# EAGLE design Tecla Shield Through Hole V1 (EAGLE 5.07)
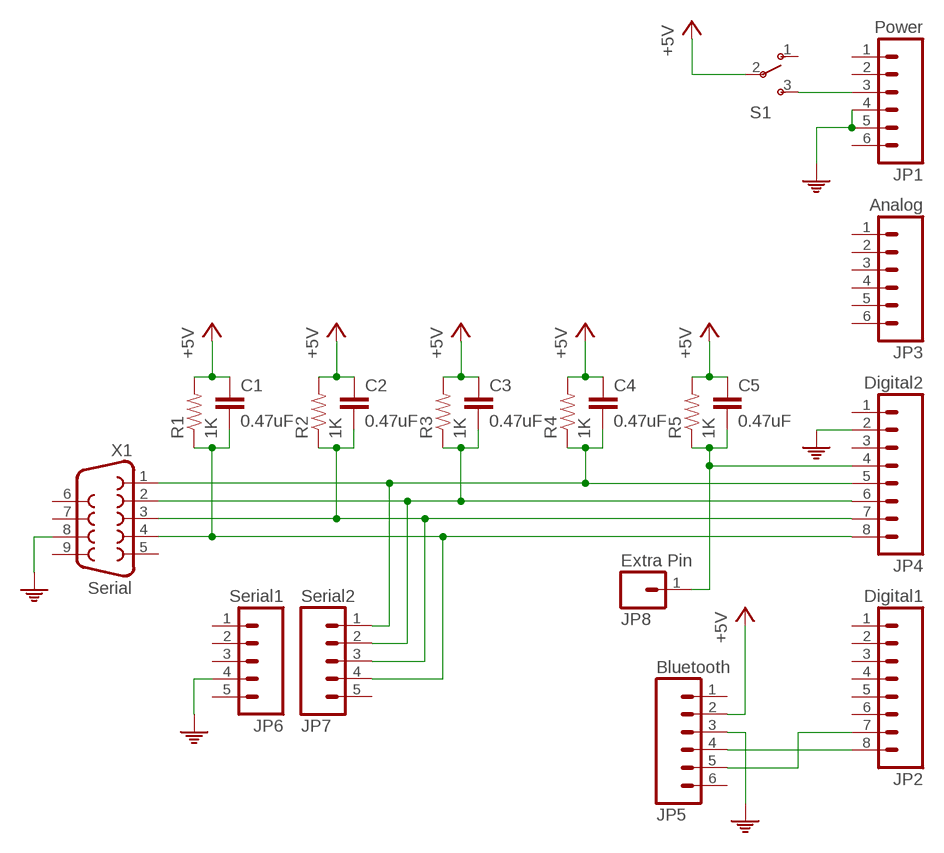
[diagram p0: schematic, sheet 1]

## Parts
C1  0.47uF  CAPPTH  [CAP-PTH-SMALL]
C2  0.47uF  CAPPTH  [CAP-PTH-SMALL]
C3  0.47uF  CAPPTH  [CAP-PTH-SMALL]
C4  0.47uF  CAPPTH  [CAP-PTH-SMALL]
C5  0.47uF  CAPPTH  [CAP-PTH-SMALL]
JP1  Power  M06SIP  [1X06]
JP2  Digital1  M08  [1X08]
JP3  Analog  M06SIP  [1X06]
JP4  Digital2  M08  [1X08]
JP5  Bluetooth  M06SIP  [1X06]
JP6  Serial1  M05  [1X05]
JP7  Serial2  M05  [1X05]
JP8  Extra Pin  M01PTH  [1X01]
R1  1K  RESISTORPTH1  [AXIAL-0.3]
R2  1K  RESISTORPTH1  [AXIAL-0.3]
R3  1K  RESISTORPTH1  [AXIAL-0.3]
R4  1K  RESISTORPTH1  [AXIAL-0.3]
R5  1K  RESISTORPTH1  [AXIAL-0.3]
S1  SWITCH-SPST  [SWITCH-SPST]
X1  Serial  DB9  [DB9]

## Nets
+5V: C1.1 C2.1 C3.1 C4.1 C5.1 JP5.2 R1.P$2 R2.P$2 R3.P$2 R4.P$2 R5.P$2 S1.2(P)
N$1: JP2.8 JP5.4
N$2: JP2.7 JP5.5
N$3: JP1.3 S1.3(S)
N$4: C3.2 JP4.6 JP7.2 R3.P$1 X1.2
N$5: C4.2 JP4.5 JP7.1 R4.P$1 X1.1
N$6: C5.2 JP4.4 JP8.1 R5.P$1
N$16: C1.2 JP4.8 JP7.4 R1.P$1 X1.4
PE: JP1.4 JP1.5 JP4.2 JP5.3 JP6.4 X1.8
X1: C2.2 JP4.7 JP7.3 R2.P$1 X1.3
Unconnected: JP1.1 JP1.2 JP1.6 JP2.1 JP2.2 JP2.3 JP2.4 JP2.5 JP2.6 JP3.1 JP3.2 JP3.3 JP3.4 JP3.5 JP3.6 JP4.1 JP4.3 JP5.1 JP5.6 JP6.1 JP6.2 JP6.3 JP6.5 JP7.5 S1.1(O) X1.5 X1.6 X1.7 X1.9

## Library data of the parts
C1-C5 = SparkFun-3-2-07:CAP: Capacitor Standard 0603 ceramic capacitor, and 0.1" leaded capacitor.
JP1 JP3 JP5 = SparkFun-3-2-07:M06: Header 6 Standard 6-pin 0.1" header. Use with straight break away headers (SKU : PType-HD), right angle break away headers (PType-HD-RightAngle), swiss pins (PType-30F), machine pins (PType-MP), and female headers (PType-FH). Molex polarized connector foot print use with SKU : Con-Hdr with associated crimp pins and housings.
JP2 JP4 = SparkFun-3-2-07:M08: Header 8 Standard 8-pin 0.1" header. Use with straight break away headers (SKU : PType-HD), right angle break away headers (PType-HD-RightAngle), swiss pins (PType-30F), machine pins (PType-MP), and female headers (PType-FH). Molex polarized connector foot print use with SKU : Con-Hdr with associated crimp pins and housings.
JP6 JP7 = SparkFun-3-2-07:M05: Header 5 Standard 5-pin 0.1" header. Use with straight break away headers (SKU : PType-HD), right angle break away headers (PType-HD-RightAngle), swiss pins (PType-30F), machine pins (PType-MP), and female headers (PType-FH). Molex polarized connector foot print use with SKU : Con-Hdr with associated crimp pins and housings.
JP8 = SparkFun-3-2-07:M01: Header 1 Standard 1-pin 0.1" header. Use with straight break away headers (SKU : PType-HD), right angle break away headers (PType-HD-RightAngle), swiss pins (PType-30F), machine pins (PType-MP), and female headers (PType-FH).
R1-R5 = SparkFun-3-2-07:RESISTOR: Resistor Basic schematic elements and footprints for 0603, 1206, and PTH 1/10th watt (small) resistors.
S1 = SparkFun-3-2-07:SWITCH-SPST: SPST Switch Simple slide switch. Spark Fun Electronics SKU : Comp-SW1
X1 = SparkFun-3-2-07:DB9: DB9 Connector Standard DB9 (D-Sub 9) serial connector. Can be used for CAN bus as well as RS485 and RS232. Footprint production proven. Spark Fun Electronics SKU : PType-DB9-PCB

## Board
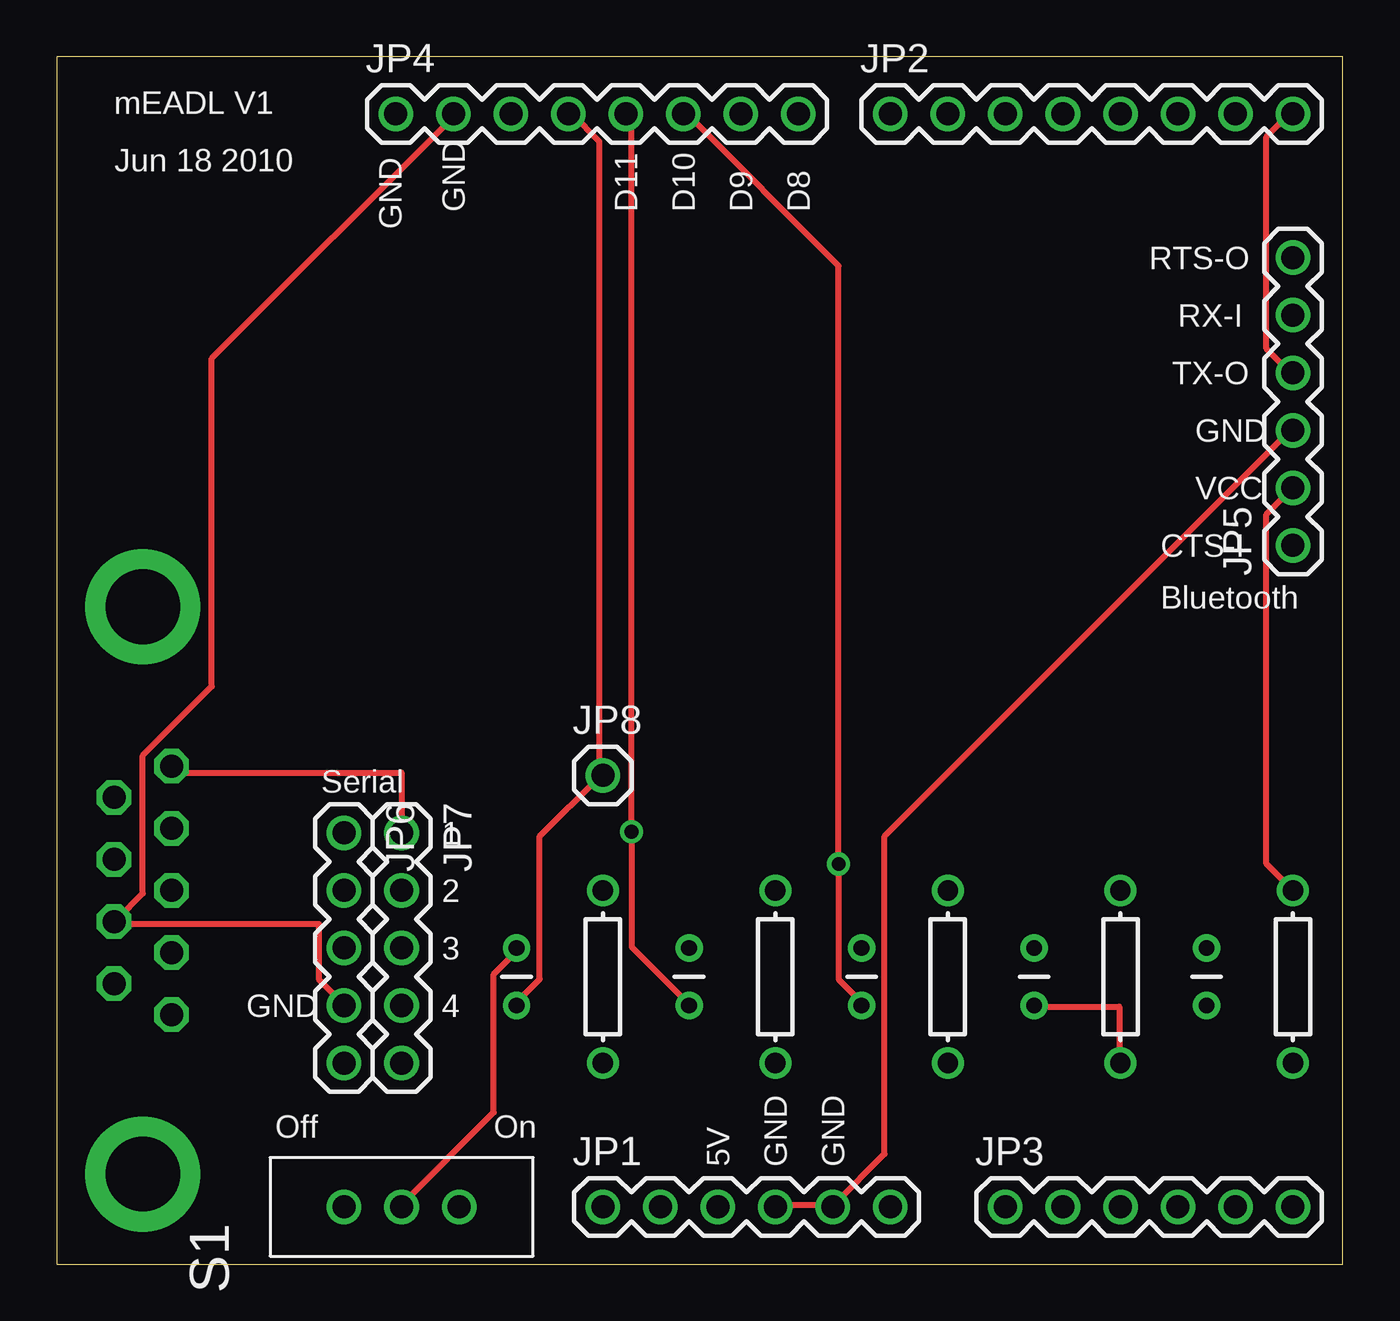
[diagram p1: board, top side]
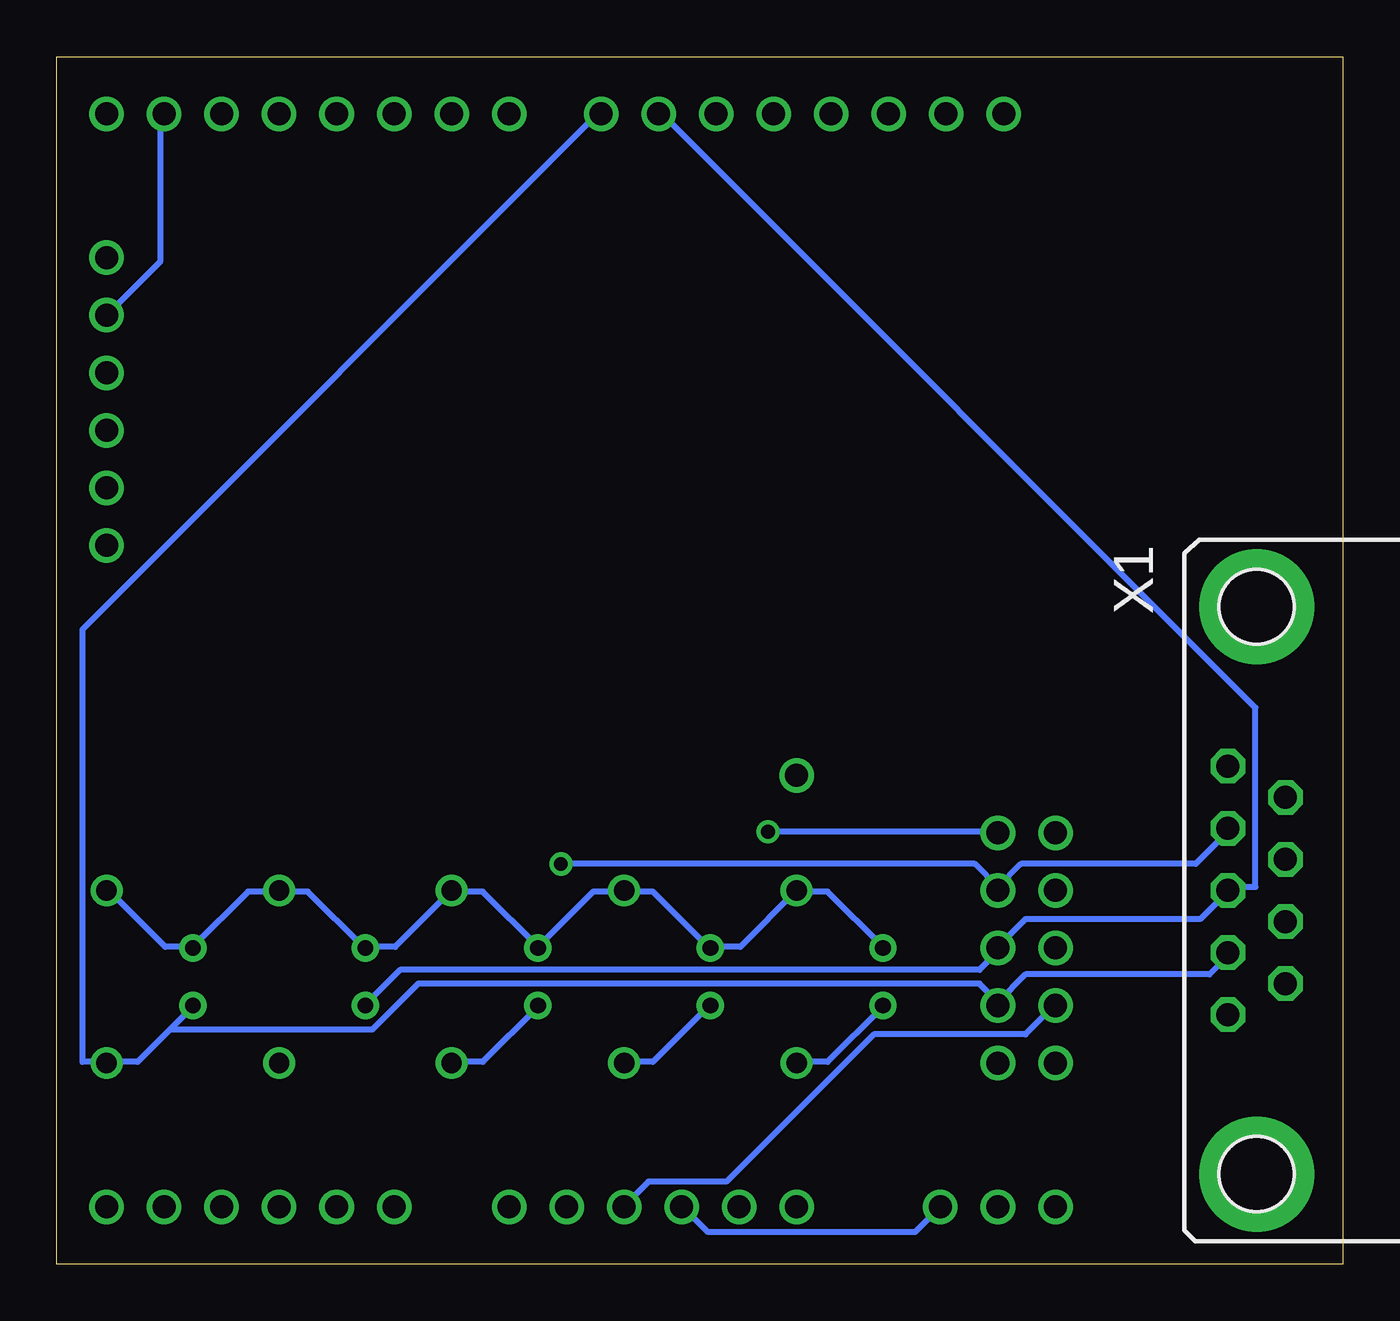
[diagram p2: board, bottom side, seen from below]

Size 56.82 x 53.33 mm. Coordinates in mm from the lower left corner, seen from the top.
Outline: 0,0 56.82,0 56.82,53.33 0,53.33 0,0
Copper layers (1*16): Top 0.035mm / dielectric 1.5mm / Bottom 0.035mm
Design rules "default *": minimum track width 10mil, minimum drill 24mil, track to track 8mil, track to pad 8mil, pad to pad 8mil, via to via 8mil, smd to smd 8mil, copper to edge 40mil, drill to drill 8mil, minimum pad ring 10mil, minimum via ring 8mil, stop-mask expansion 4mil, vias tented up to drill 0mil, thermal gap 10mil

### Footprints (pad centres in the part's own frame; a part is rotated, then mirrored left to right if it is on the bottom)
CAP-PTH-SMALL = drill 0.7 round: 1 0,0; 2 2.54,0
1X06 = drill 1.016 round: 1 0,0; 2 2.54,0; 3 5.08,0; 4 7.62,0; 5 10.16,0; 6 12.7,0
1X08 = drill 1.016 round: 1 0,0; 2 2.54,0; 3 5.08,0; 4 7.62,0; 5 10.16,0; 6 12.7,0; 7 15.24,0; 8 17.78,0
1X05 = drill 1.016 round: 1 0,0; 2 2.54,0; 3 5.08,0; 4 7.62,0; 5 10.16,0
1X01 = drill 1.016 round: 1 0,0
AXIAL-0.3 = drill 0.9 round: P$1 -3.81,0; P$2 3.81,0
SWITCH-SPST = drill 1.016 round: 1 0,2.54; 2 0,0; 3 0,-2.54
DB9 = drill 1.016 octagon: 1 -5.486,-1.27; 2 -2.743,-1.27; 3 0,-1.27; 4 2.743,-1.27; 5 5.486,-1.27; 6 -4.115,1.27; 7 -1.372,1.27; 8 1.372,1.27; 9 4.115,1.27 | drill 3.302 pad 5.08 round: G1 -12.522,0; G2 12.522,0

### Placement (x,y rotation side)
C1  50.8,13.97 270 top
C2  43.18,13.97 270 top
C3  35.56,13.97 270 top
C4  27.94,13.97 270 top
C5  20.32,13.97 270 top
JP1  24.13,2.54 0 top
JP2  36.83,50.8 0 top
JP3  41.91,2.54 0 top
JP4  14.99,50.8 0 top
JP5  54.61,31.75 90 top
JP6  12.7,19.05 270 top
JP7  15.24,19.05 270 top
JP8  24.13,21.59 0 top
R1  54.61,12.7 90 top
R2  46.99,12.7 90 top
R3  39.37,12.7 90 top
R4  31.75,12.7 90 top
R5  24.13,12.7 90 top
S1  15.24,2.54 90 top
X1  3.81,16.51 270 bottom

### Tracks (layer width: path | path; a pad name or v marks a point on that pad's centre or on a via)
+5V
  Top 0.254: S1.2 15.24,2.64 19.3,6.71 19.3,12.8 20.32,13.82 C5.1 | JP5.2 53.44,33.12 53.44,17.68 R1.P$2
  Bottom 0.254: C5.1 20.32,14.02 22.76,16.46 23.98,16.46 R5.P$2 26.62,14.02 27.84,14.02 C4.1 28.04,14.02 30.48,16.46 31.7,16.46 R4.P$2 31.9,16.46 33.12,16.46 35.56,14.02 | 50.8,14.02 48.36,16.46 47.14,16.46 R2.P$2 46.94,16.46 45.72,16.46 43.28,14.02 C2.1 43.08,14.02 41.86,14.02 R3.P$2 39.22,16.46 38,16.46 35.56,14.02 | 50.8,14.02 52.02,14.02 54.46,16.46 R1.P$2 | 50.8,14.02 C1.1 | 35.56,14.02 C3.1
N$1
  Top 0.254: JP5.4 54.46,39.42 53.44,40.44 53.44,49.78 54.46,50.8 JP2.8
N$2
  Bottom 0.254: JP5.5 52.22,44.3 52.22,50.8 JP2.7
N$3
  Bottom 0.254: S1.3 18.9,1.42 28.04,1.42 29.06,2.44 JP1.3
N$4  (via drill 0.61)
  Top 0.254: JP4.6 27.84,50.8 34.54,44.09 v34.54,17.68 34.54,12.6 35.56,11.58 C3.2
  Bottom 0.254: C3.2 35.56,11.38 38,8.94 39.22,8.94 R3.P$1 | 15.24,16.66 14.22,17.68 6.5,17.68 5.08,19.1 X1.2 | 15.24,16.66 16.26,17.68 v34.54,17.68 | 15.24,16.66 JP7.2
N$5  (via drill 0.61)
  Top 0.254: C4.2 27.84,11.58 25.4,14.02 v25.4,19.1 25.4,50.6 25.2,50.8 JP4.5 | JP7.1 15.24,21.72 5.33,21.72 X1.1
  Bottom 0.254: C4.2 28.04,11.38 30.48,8.94 31.7,8.94 R4.P$1 | v25.4,19.1 15.24,19.1 JP7.1
N$6
  Top 0.254: C5.2 20.32,11.58 21.34,12.6 21.34,18.9 23.98,21.54 JP8.1 23.98,21.74 23.98,49.58 22.76,50.8 JP4.4
  Bottom 0.254: C5.2 20.32,11.38 22.76,8.94 23.98,8.94 R5.P$1
N$16
  Bottom 0.254: 15.24,11.58 14.02,12.8 5.89,12.8 5.08,13.61 X1.4 | 51.82,10.36 53.24,8.94 54.46,8.94 R1.P$1 54.66,8.94 55.68,8.94 55.68,28.04 32.92,50.8 JP4.8 | 51.82,10.36 50.8,11.38 C1.2 | 15.24,11.58 16.05,12.39 40.84,12.39 42.88,10.36 51.82,10.36 | 15.24,11.58 JP7.4
PE
  Top 0.254: JP6.4 12.6,11.58 11.58,12.6 11.58,15.04 2.64,15.04 X1.8 2.67,15.24 3.81,16.38 3.81,22.48 6.86,25.53 6.86,40.01 17.53,50.67 JP4.2 17.48,50.8 | JP1.4 31.9,2.64 34.14,2.64 JP1.5 34.34,2.64 36.58,4.88 36.58,18.9 54.46,36.78 JP5.3
  Bottom 0.254: JP6.4 12.8,11.38 14.02,10.16 20.73,10.16 27.23,3.66 30.68,3.66 31.7,2.64 JP1.4
X1
  Top 0.254: C2.2 43.28,11.38 46.94,11.38 46.94,8.94 R2.P$1
  Bottom 0.254: JP4.7 30.07,50.8 3.86,24.59 3.86,16.66 5.08,16.66 X1.3 5.08,16.46 6.3,15.24 14.02,15.24 15.24,14.02 JP7.3 15.24,13.82 16.05,13.01 41.66,13.01 43.08,11.58 C2.2

### Text on the board
tPlace: mEADL V1 | Jun 18 2010 | GND | GND | D11 | D10 | D9 | D8 | RTS-O | RX-I | TX-O | GND | VCC | CTS-I | Bluetooth | Serial | 1 | 2 | 3 | GND | 4 | Off | On | 5V | GND | GND